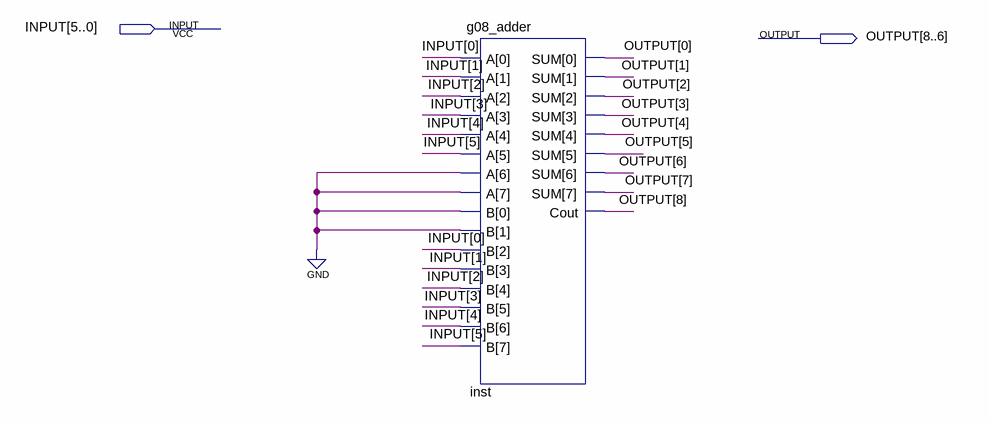
[diagram p0: schematic sheet]
// Quartus schematic FLOOR13.bdf as structural Verilog: 1 symbols, 2 pins
module FLOOR13 (
  input  [5:0] INPUT,
  output [8:0] OUTPUT
);

  g08_adder inst (.A({2'b00, INPUT}), .B({INPUT, 2'b00}), .SUM(OUTPUT[7:0]), .Cout(OUTPUT[8]));
endmodule
